# EAGLE design top5v (EAGLE 7.1.0)
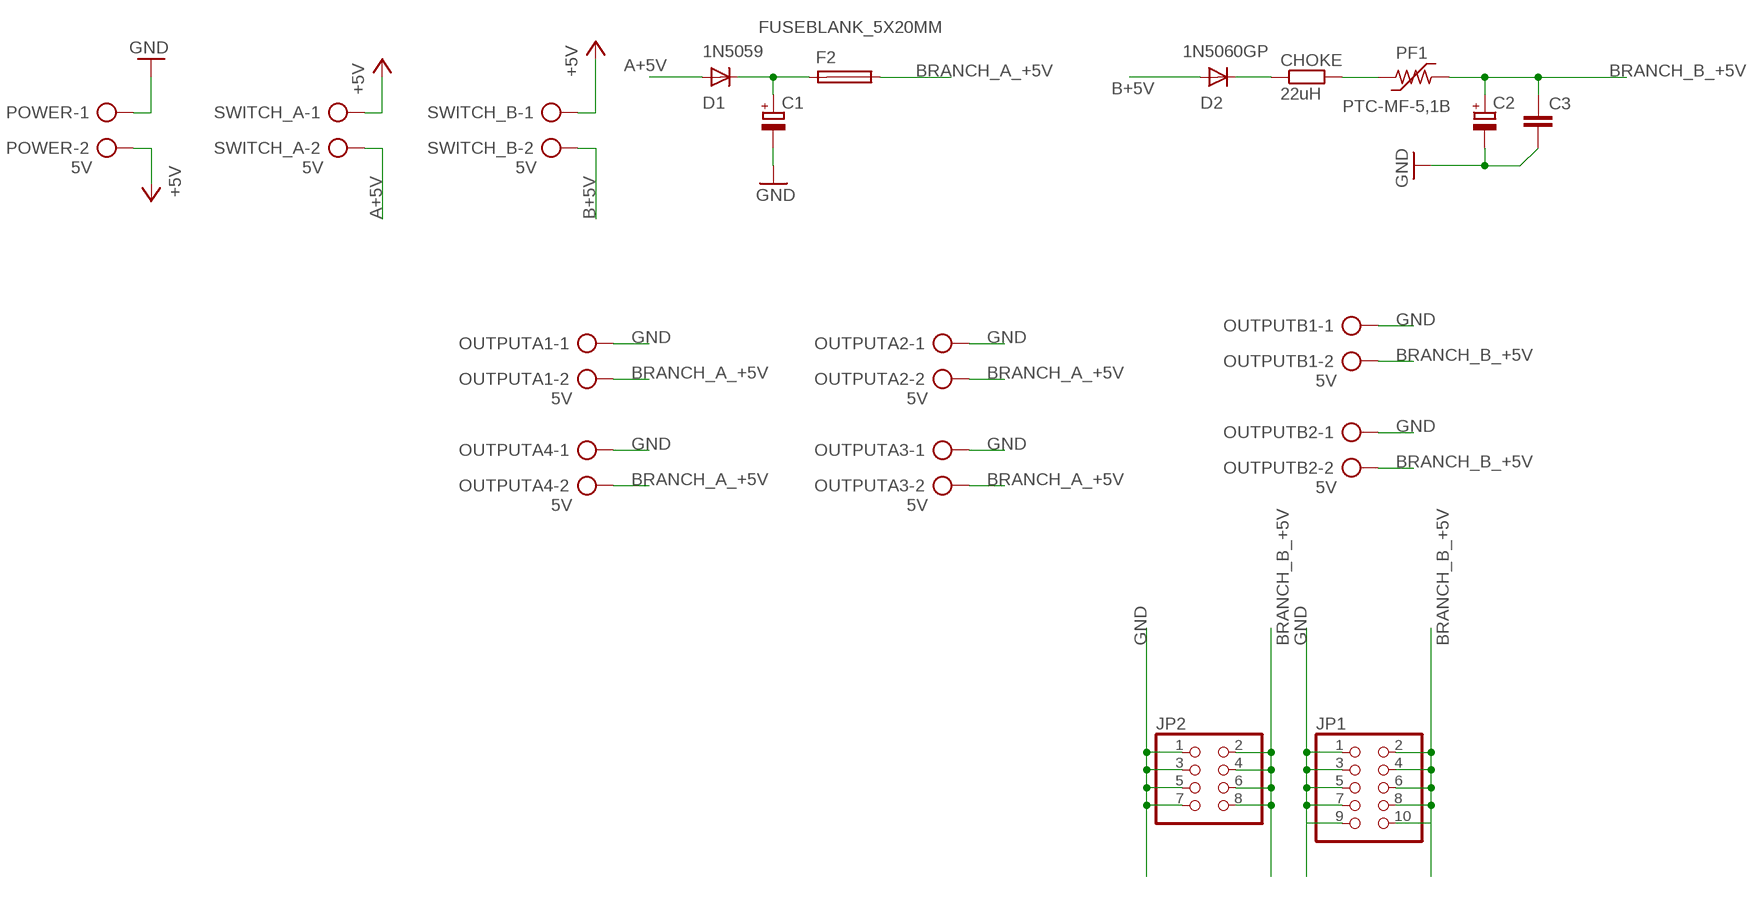
[diagram p0: schematic, sheet 1]

## Parts
C1  CPOL-EUE2.5-5  [E2,5-5]
C2  CPOL-EUE2.5-5  [E2,5-5]
C3  C-EU025-024X044  [C025-024X044]
CHOKE  22uH  R-EU_0411_15  [0411/15]
D1  1N5059  [DO204-10]
D2  1N5060GP  [DO15-12]
F2  FUSEBLANK_5X20MM  [FUSE_HOLDER_5X20MM]
JP1  PINHD-2X5  [2X05]
JP2  PINHD-2X4  [2X04]
OUTPUTA1  5V  AK500/2  [AK500/2]
OUTPUTA2  5V  AK500/2  [AK500/2]
OUTPUTA3  5V  AK500/2  [AK500/2]
OUTPUTA4  5V  AK500/2  [AK500/2]
OUTPUTB1  5V  AK500/2  [AK500/2]
OUTPUTB2  5V  AK500/2  [AK500/2]
PF1  PTC-MF-5,1B  [MF-5/1B]
POWER  5V  AK500/2  [AK500/2]
SWITCH_A  5V  AK500/2  [AK500/2]
SWITCH_B  5V  AK500/2  [AK500/2]

## Nets
+5V: POWER.2 SWITCH_A.1 SWITCH_B.1
A+5V: D1.A SWITCH_A.2
B+5V: D2.A SWITCH_B.2
BRANCH_A_+5V: F2.1 OUTPUTA1.2 OUTPUTA2.2 OUTPUTA3.2 OUTPUTA4.2
BRANCH_B_+5V: C2.+ C3.1 JP1.2 JP1.4 JP1.6 JP1.8 JP1.10 JP2.2 JP2.4 JP2.6 JP2.8 OUTPUTB1.2 OUTPUTB2.2 PF1.2
GND: C1.- C2.- C3.2 JP1.1 JP1.3 JP1.5 JP1.7 JP1.9 JP2.1 JP2.3 JP2.5 JP2.7 OUTPUTA1.1 OUTPUTA2.1 OUTPUTA3.1 OUTPUTA4.1 OUTPUTB1.1 OUTPUTB2.1 POWER.1
N$1: CHOKE.1 D2.C
N$2: CHOKE.2 PF1.1
N$12: C1.+ D1.C F2.2

## Library data of the parts
C1 C2 = rcl:CPOL-EU: POLARIZED CAPACITOR, European symbol
C3 = resistor:C-EU: CAPACITOR, European symbol; SPICEPREFIX: C
CHOKE = resistor:R-EU_: RESISTOR, European symbol; SPICEPREFIX: R
D1 = diode:1N5059: DIODE controlled avalanche rectifier
D2 = diode:1N5060GP: DIODE controlled avalanche rectifier
F2 = fuse:FUSE: Fuse; OC_FARNELL: unknown; OC_NEWARK: unknown
JP1 = pinhead:PINHD-2X5: PIN HEADER
JP2 = pinhead:PINHD-2X4: PIN HEADER
OUTPUTA1-OUTPUTA4 OUTPUTB1 OUTPUTB2 POWER SWITCH_A SWITCH_B = con-ptr500:AK500/2: CONNECTOR; OC_FARNELL: unknown; OC_NEWARK: unknown
PF1 = polyswitch:PTC-: POLYSWITCH Polyswitch Resetable Fuses

## Board
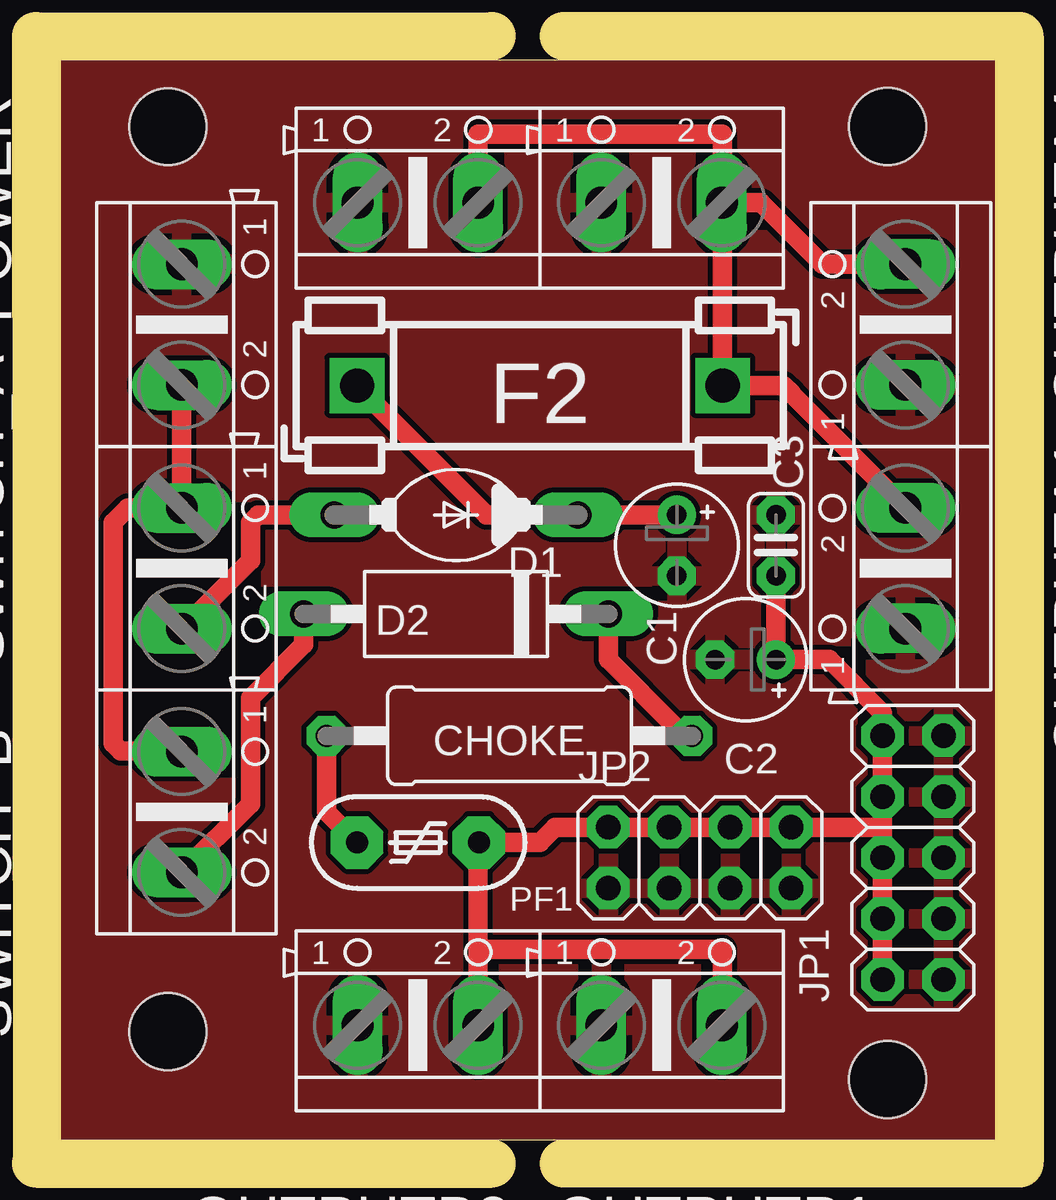
[diagram p1: board, top side]

Size 39 x 45 mm. Coordinates in mm from the lower left corner, seen from the top.
Outline: 0,0 39,0 39,45 0,45 0,0
Copper layers (1*16): Top 0.035mm / dielectric 1.5mm / Bottom 0.035mm
Design rules "default *": minimum track width 10mil, minimum drill 24mil, track to track 8mil, track to pad 8mil, pad to pad 8mil, via to via 8mil, smd to smd 8mil, copper to edge 1mil, drill to drill 8mil, minimum pad ring 15mil, minimum via ring 8mil, stop-mask expansion 4mil, vias tented up to drill 0mil, thermal gap 10mil
Holes 3.2 mm at 34.5,2.5 4.5,4.5 4.5,42.22 34.5,42.23
Milling: 6 lines

### Footprints (pad centres in the part's own frame; a part is rotated, then mirrored left to right if it is on the bottom)
E2,5-5 = drill 0.813 pad 1.6: + -1.27,0 | drill 0.813 pad 1.6 octagon: - 1.27,0
C025-024X044 = drill 0.813 octagon: 1 -1.27,0; 2 1.27,0
0411/15 = drill 0.914 octagon: 1 -7.62,0; 2 7.62,0
DO204-10 = drill 1.118 long: A 5.08,0; C -5.08,0
DO15-12 = drill 1.118 long: A 6.35,0; C -6.35,0
FUSE_HOLDER_5X20MM = drill 1.422 pad 2.286 square: 1 0,0; 2 15.24,0
2X05 = drill 1.016 octagon: 1 -5.08,-1.27; 2 -5.08,1.27; 3 -2.54,-1.27; 4 -2.54,1.27; 5 0,-1.27; 6 0,1.27; 7 2.54,-1.27; 8 2.54,1.27; 9 5.08,-1.27; 10 5.08,1.27
2X04 = drill 1.016 octagon: 1 -3.81,-1.27; 2 -3.81,1.27; 3 -1.27,-1.27; 4 -1.27,1.27; 5 1.27,-1.27; 6 1.27,1.27; 7 3.81,-1.27; 8 3.81,1.27
AK500/2 = drill 1.321 long: 1 -2.515,0; 2 2.515,0
MF-5/1B = drill 0.914 pad 2.184 octagon: 1 -2.54,0; 2 2.54,0

### Placement (x,y rotation side)
C1  25.72,24.77 270 top
C2  28.57,20 180 top
C3  29.84,24.77 90 top
CHOKE  18.73,16.83 180 top
D1  16.51,26.04 180 top
D2  16.51,21.91 180 top
F2  27.62,31.43 180 top
JP1  35.56,11.75 90 top
JP2  26.67,11.75 0 top
OUTPUTA1  35.24,23.81 90 top
OUTPUTA2  14.92,39.05 0 top
OUTPUTA3  25.08,39.05 0 top
OUTPUTA4  35.24,33.97 90 top
OUTPUTB1  25.08,4.76 0 top
OUTPUTB2  14.92,4.76 0 top
PF1  14.92,12.38 0 top
POWER  5.08,33.97 270 top
SWITCH_A  5.08,23.81 270 top
SWITCH_B  5.08,13.65 270 top

### Tracks (layer width: path | path; a pad name or v marks a point on that pad's centre or on a via)
+5V
  Top 0.813: POWER.2 SWITCH_A.1 2.83,26.33 2.22,25.72 2.22,16.51 2.54,16.19 5.05,16.19 SWITCH_B.1
A+5V
  Top 0.813: 9.53,26.04 D1.A 8.26,26.04 7.94,25.72 7.94,24.13 5.11,21.3 SWITCH_A.2
B+5V
  Top 0.813: D2.A 10.16,20.64 7.94,18.41 7.94,13.99 SWITCH_B.2
BRANCH_A_+5V
  Top 0.813: OUTPUTA3.2 27.62,39.05 27.62,41.91 17.44,41.91 OUTPUTA2.2 | OUTPUTA3.2 27.62,39.03 F2.1 30.16,31.43 30.48,31.11 30.48,31.09 OUTPUTA1.2 | OUTPUTA4.2 31.77,36.49 29.21,39.05 OUTPUTA3.2
BRANCH_B_+5V
  Top 0.813: OUTPUTB1.2 27.62,4.76 27.62,7.94 17.44,7.94 | 17.44,7.94 OUTPUTB2.2 | C3.1 C2.+ 32.07,20 34.29,17.78 JP1.10 JP1.8 34.29,13.02 | 34.29,13.02 JP1.6 JP1.4 JP1.2 | JP2.6 JP2.8 34.29,13.02 | JP2.6 JP2.4 JP2.2 | 17.44,7.94 17.44,12.36 PF1.2 20,12.38 20.64,13.02 JP2.6
GND
  pour Top: 0,45 39,45 39,0 0,0
N$1
  Top 0.813: CHOKE.1 25.72,17.14 22.86,20 D2.C
N$2
  Top 0.813: PF1.1 11.11,13.65 CHOKE.2
N$12
  Top 0.813: F2.2 17.78,26.04 D1.C C1.+